# Altium schematic sheet Servo Motor.SchDoc
size A
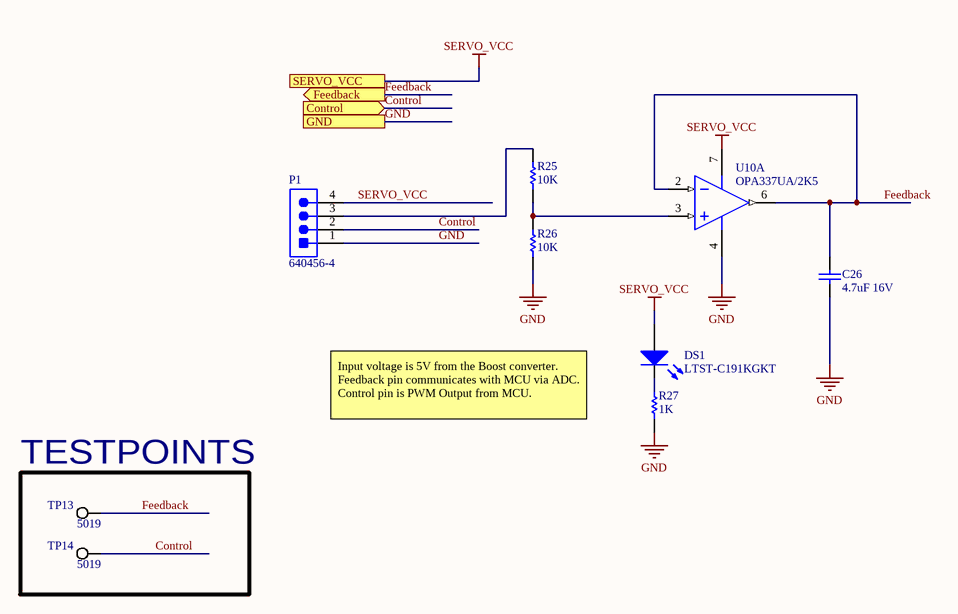
[diagram p0: Servo Motor.SchDoc]

## Parts
C26  4.7uF 16V  [CAPC0805(2012)145_N]
DS1  LTST-C191KGKT  [LITE-ON-LTST-C191KRKT-2_V]
P1  640456-4  [TECO-640456-4]
R25  10K  [RESC2013X70X40ML20T20]
R26  10K  [RESC2013X70X40ML20T20]
R27  1K  [RESC0603(1608)_M]
TP13  5019  [KSTN-5019_V]
TP14  5019  [KSTN-5019_V]
U10  OPA337UA/2K5  [D0008A_N]  (part A of 2)

## Blocks framed on the sheet
TESTPOINTS: TP13 TP14

## Ports
Control (in), Feedback (out), GND, SERVO_VCC

## Nets
GND: C26.1 P1.1 R26.1 R27.2 U10.4(V-) ; port GND
SERVO_VCC: DS1.1(A) P1.4 U10.7(V+) ; port SERVO_VCC
Control: P1.2 TP14.1 ; port Control
Feedback: C26.2 TP13.1 U10.2(IN-) U10.6(OUT) ; port Feedback
NetDS1_2: DS1.2(K) R27.1
NetP1_3: P1.3 R25.2
NetR25_1: R25.1 R26.2 U10.3(IN+)

## Notes on the sheet
- Input voltage is 5V from the Boost converter. Feedback pin communicates with MCU via ADC. Control pin is PWM Output from MCU.

## Library data of the parts
C26 = CMP-1036-04889-1: CAP 4.7uF 16V ±10% 0805 (2012 Metric) Thickness 1.45mm SMD; Case-EIA: 0805; Case-Metric: 2012; Tolerance: Â±10%; Technology: SMT; Value: 4.7uF; Rated Voltage: 16 V; Max Thickness: 1.45 mm
DS1 = CMP-2000-05198-1: Chip LED, Green, 574 nm, 40 pF, -55 to 85 degC, 2-Pin SMD, RoHS, Tape and Reel; Manufacturer: Lite-On; Rad Hardened: No; Emitting Color: YellowGreen; Product Height (mm): 0.55mm; Forward Voltage: 2.4V; Number of Elements: 1; Dominant Wave Length: 571nm; DELETED: Compliant; Viewing Angle: 130deg; High Brightness: Yes; Peak Wavelength: 574nm; Type: Uni-Color; Forward Current: 30mA; Product Length (mm): 1.6mm; Luminous Intensity: 35mcd; Test Current (It): 20mA; Chip Material: AlGaInP; Product Depth (mm): 0.8mm; Shape Type: Rectangular; Reverse Voltage: 5V; Power Dissipation: 75W; Pin Count: 2; Lens Dimensions: 1.1X0.8X0.37mm; Packaging: TapeandReel; Main Category: ChipLED; Operating Temperature Classification: Industrial; Package Type: ChipLed; Mounting: SurfaceMount; Lum Intensity: 35mcd; Operating Temp Range: -55Cto85C; Datasheet Version: Jan-07; Datasheet URL: http://download.siliconexpert.com/pdfs/2007/08/26/semi_b/manual/lot/ds/ltst-c191kgkt.pdf; Manufacturer URL: http://www.us.liteon.com/
P1 = CMP-2000-05419-1: Male Header, Pitch 2.54 mm, 1 x 4 Position, Height 10.03 mm, Tail Length 3.56 mm, RoHS, Bulk; Manufacturer: TE Connectivity; Material, Housing: Polyester; Primary Type: InterconnectSystem; Mount Angle: Vertical; Color, Housing: White; Current, Rating: 5 / A; Agency Approvals: CSA,UL; Contact Termination Area Plating: Tin; Temperature, Operating: -55to+105 / degC; Standards: RoHSCompliant,ELVCompliant,UL94V-0; Number of Positions: 4; Brand/Series: MTA-100Series; Angle: Straight; Pin Spacing: 0.1 / "; Material, Contact: CopperAlloy; Connector Type: MTA-100; Special Features: Pinstrip; Mounting Hole Size: 0.04 / "; Contact Centerline Spacing: 0.100 / in.; Voltage, Rating: 250 / V; Manufacturer URL: http://www.te.com/; Length, Pin: 0.14 / "; Length, Overall: 0.4 / "; Color: White; Flammability Rating: UL94V-0; Mounting Type: PCMount; Termination: Solder; Datasheet URL: https://datasheet.ciiva.com/16286/eng-ds-82056-mta-0608-16286228.pdf; Number of Contacts: 4; Contact Shape: Square; Contact Mating Area Plating: Tin; Length, Terminal Post: 0.14 / in.; Size, Post: 0.025 / in.; Contact Plating: Tin; Type: PCBPlug; Datasheet Version: Dec-14; Number of Rows: 1
R25 R26 = CMP-2001-04376-1: Manufacturer: Panasonic; Part Number: ERJ-6ENF1002V
R27 = CMP-1012-00510-1: 1K 0.1W 1% 0603 (1608 Metric)  SMD; Case-Metric: 1608; Case-EIA: 0603; Value: 1000.00 Ohm; Technology: SMT; Tolerance: 1 %; Power: 0.1 W
TP13 TP14 = CMP-1672-00008-1: Test Point, 1 Position SMD, RoHS, Tape and Reel; ComponentLink1Description: Manufacturer URL; Package Quantity: 1000; DatasheetVersion: 03/2014; Packaging: Tape and Reel; ComponentLink2URL: http://www.keyelco.com/product-pdf.cfm?p=1357; ComponentLink1URL: http://www.keyelco.com/; Mount: Surface Mount; Contact Plating: Silver; PackageDescription: 1-Pin Surface Mount Device, Body 3.81 x 2.03 mm; Pins: 1; RoHSCompliant: True; Mounting Technology: Surface Mount; ComponentLink2Description: Datasheet; PackageReference: 5019
U10 = CMP-0272-00397-3: MicroSIZE, Single-Supply CMOS Operational Amplifier MicroAmplifier(TM) Series, 2.5 to 5.5 V, -40 to 85 degC, 8-pin SOIC (D8), Green (RoHS & no Sb/Br); Manufacturer: Texas Instruments; Total Supply Voltage(Min)(+5V is 5, +/-5V is 10): 2.5; CMRR(Min)(dB): 74; Rating: Catalog; Vio (25C)(Max)(mV): 3; IIB(Max)(pA): 10; Packing: LARGE T&R; Sub Family: Low Input Bias Current Amp (<=10pA), Low Supply Voltage Amplifier (<=2.7V), Precision Amplifier; Number of Channels: 1; Slew Rate(Typ)(V/us): 1.2; Offset Drift(Typ)(uV/C): 2; Total Supply Voltage(Max)(+5V is 5, +/-5V is 10): 5.5; DatasheetVersion: SBOS077B; Mounting Technology: Surface Mount; PackageVersion: 4040047-3/M, 06/2011; ComponentLink1Description: Manufacturer URL; Eco-Plan: Green (RoHS & no Sb/Br); PartNumber: OPA337UA/2K5; ComponentLink3Description: Package Specification; ComponentLink2Description: Datasheet; GBW(Typ)(MHz): 3; ComponentLink2URL: http://www.ti.com/lit/ds/symlink/opa337.pdf; PackageReference: D0008A; ComponentLink1URL: http://www.ti.com/; Code_JEDEC: MS-012; ComponentLink3URL: http://www.ti.com/litv/pdf/msoi002j; PackageDescription: 8-Pin Plastic Small Outline, Body 4.9 x 3.9 mm, Pitch 1.27 mm; Iq per channel(Max)(mA): 1